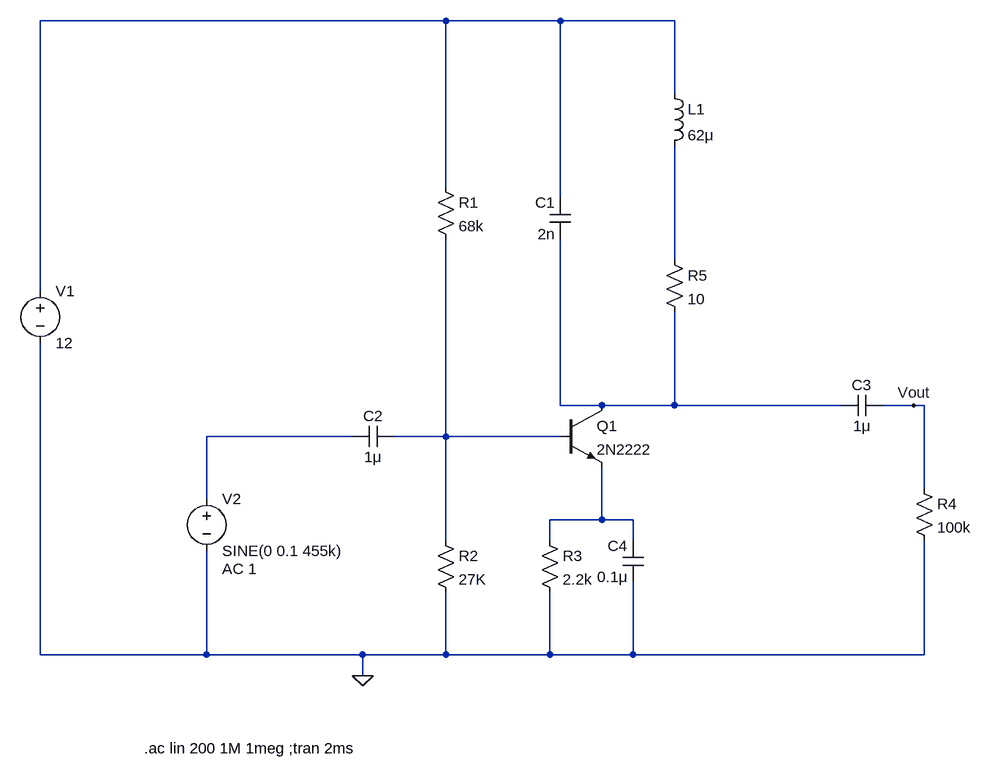
[diagram p0: schematic lab1-3.asc]
lab1-3.asc, the LTspice schematic file:
Version 4
SHEET 1 1324 864
WIRE 512 -272 -112 -272
WIRE 688 -272 512 -272
WIRE 864 -272 688 -272
WIRE 864 -160 864 -272
WIRE 512 -16 512 -272
WIRE 688 0 688 -272
WIRE 864 96 864 -80
WIRE -112 144 -112 -272
WIRE 688 320 688 64
WIRE 752 320 688 320
WIRE 864 320 864 176
WIRE 864 320 752 320
WIRE 1120 320 864 320
WIRE 1232 320 1184 320
WIRE 1248 320 1232 320
WIRE 368 368 144 368
WIRE 512 368 512 64
WIRE 512 368 432 368
WIRE 688 368 512 368
WIRE 1248 448 1248 320
WIRE 144 464 144 368
WIRE 752 496 752 416
WIRE 752 496 672 496
WIRE 800 496 752 496
WIRE 512 528 512 368
WIRE 672 528 672 496
WIRE 800 528 800 496
WIRE -112 704 -112 224
WIRE 144 704 144 544
WIRE 144 704 -112 704
WIRE 384 704 144 704
WIRE 512 704 512 608
WIRE 512 704 384 704
WIRE 672 704 672 608
WIRE 672 704 512 704
WIRE 800 704 800 592
WIRE 800 704 672 704
WIRE 1248 704 1248 528
WIRE 1248 704 800 704
WIRE 384 736 384 704
FLAG 1232 320 Vout
FLAG 384 736 0
SYMBOL voltage -112 128 R0
WINDOW 123 0 0 Left 0
WINDOW 39 0 0 Left 0
SYMATTR InstName V1
SYMATTR Value 12
SYMBOL voltage 144 448 R0
WINDOW 123 24 124 Left 2
WINDOW 39 0 0 Left 0
SYMATTR Value2 AC 1
SYMATTR InstName V2
SYMATTR Value SINE(0 0.1 455k)
SYMBOL cap 704 64 R180
WINDOW 0 24 56 Left 2
WINDOW 3 24 8 Left 2
SYMATTR InstName C1
SYMATTR Value 2n
SYMBOL cap 368 384 R270
WINDOW 0 32 32 VTop 2
WINDOW 3 0 32 VBottom 2
SYMATTR InstName C2
SYMATTR Value 1μ
SYMBOL cap 1120 336 R270
WINDOW 0 32 32 VTop 2
WINDOW 3 0 32 VBottom 2
SYMATTR InstName C3
SYMATTR Value 1μ
SYMBOL cap 816 592 R180
WINDOW 0 24 56 Left 2
WINDOW 3 24 8 Left 2
SYMATTR InstName C4
SYMATTR Value 0.1μ
SYMBOL npn 688 320 R0
SYMATTR InstName Q1
SYMATTR Value 2N2222
SYMBOL res 656 512 R0
SYMATTR InstName R3
SYMATTR Value 2.2k
SYMBOL res 496 -32 R0
SYMATTR InstName R1
SYMATTR Value 68k
SYMBOL res 496 512 R0
SYMATTR InstName R2
SYMATTR Value 27K
SYMBOL ind 848 -176 R0
SYMATTR InstName L1
SYMATTR Value 62μ
SYMBOL res 848 80 R0
SYMATTR InstName R5
SYMATTR Value 10
SYMBOL res 1232 432 R0
SYMATTR InstName R4
SYMATTR Value 100k
TEXT 48 848 Left 2 !.ac lin 200 1M 1meg ;tran 2ms

The netlist it stands for:
* lab1-3.asc
V1 N001 0 12
V2 N004 0 SINE(0 0.1 455k) AC 1
C1 N003 N001 2n
C2 N004 N005 1μ
C3 N003 Vout 1μ
C4 0 N006 0.1μ
Q1 N003 N005 N006 0 2N2222
R3 N006 0 2.2k
R1 N001 N005 68k
R2 N005 0 27K
L1 N001 N002 62μ
R5 N002 N003 10
R4 Vout 0 100k
.model NPN NPN
.model PNP PNP
.lib standard.bjt
.ac lin 200 1M 1meg ;tran 2ms
.backanno
.end